# EAGLE design LnMasterInterface (EAGLE 9.6.2)
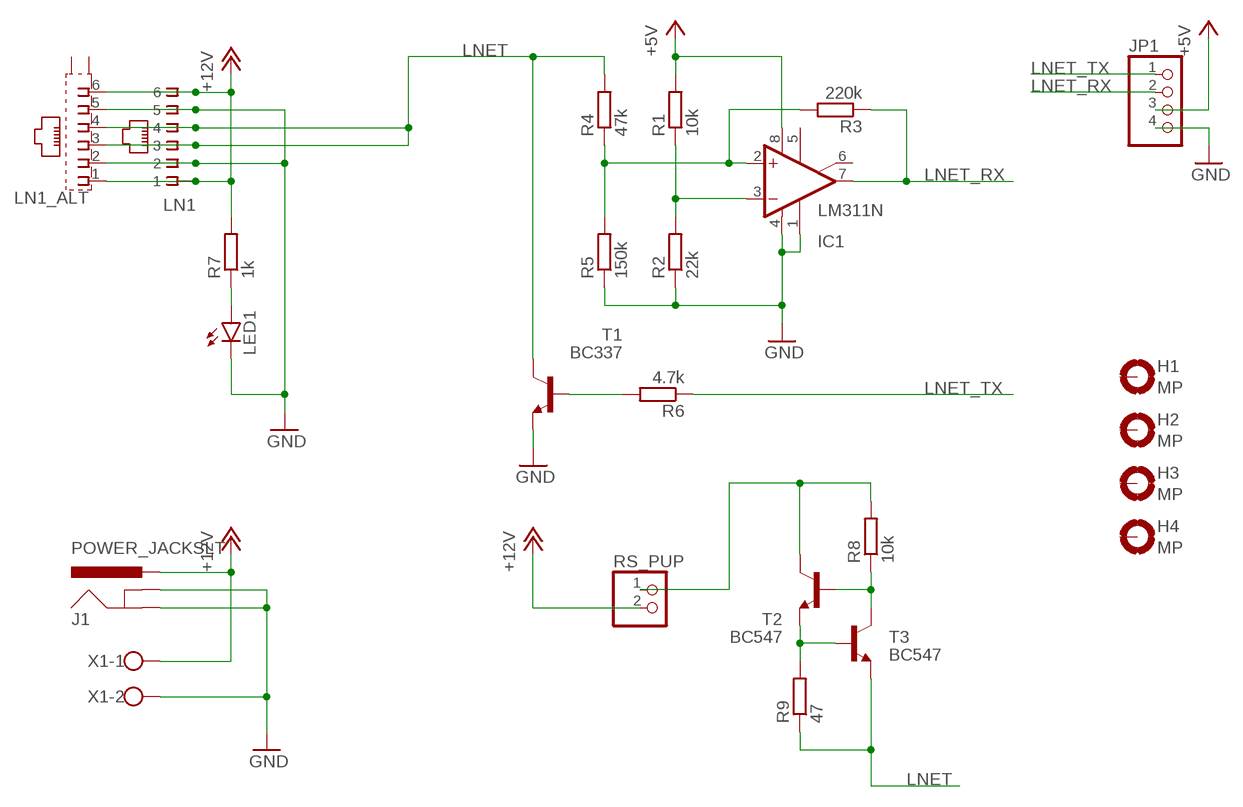
[diagram p0: schematic, sheet 1]

## Parts
H1  MP  MOUNT-PAD-ROUND3.0  [3,0-PAD]
H2  MP  MOUNT-PAD-ROUND3.0  [3,0-PAD]
H3  MP  MOUNT-PAD-ROUND3.0  [3,0-PAD]
H4  MP  MOUNT-PAD-ROUND3.0  [3,0-PAD]
IC1  LM311N  [DIL08]
J1  POWER_JACKSLT  [POWER_JACK_SLOT]
JP1  PINHD-1X4  [1X04]
LED1  LED3MM  [LED3MM]
LN1  RJ11-6X  [RJ11-NO_SHIELD]
LN1_ALT  YH-55-10  [YH-55-10]
R1  10k  R-EU_0207/2V  [0207/2V]
R2  22k  R-EU_0207/2V  [0207/2V]
R3  220k  R-EU_0207/2V  [0207/2V]
R4  47k  R-EU_0207/2V  [0207/2V]
R5  150k  R-EU_0207/2V  [0207/2V]
R6  4.7k  R-EU_0207/2V  [0207/2V]
R7  1k  R-EU_0207/2V  [0207/2V]
R8  10k  R-EU_0207/2V  [0207/2V]
R9  47  R-EU_0207/2V  [0207/2V]
RS_PUP  PINHD-1X2  [1X02]
T1  BC337  [TO92]
T2  BC547  [TO92]
T3  BC547  [TO92]
X1  W237-102  [W237-102]

## Nets
+5V: IC1.8(V+) JP1.3 R1.2
+12V [power]: J1.PWR LN1.1 LN1.6 LN1_ALT.1 LN1_ALT.6 R7.2 RS_PUP.2 X1.1
GND [power]: IC1.1(GND) IC1.4(V-) J1.GND@1(GNDBREAK) J1.GND@2(GND) JP1.4 LED1.K(C) LN1.2 LN1.5 LN1_ALT.2 LN1_ALT.5 R2.1 R5.1 T1.1(E) X1.2
LNET: LN1.3 LN1.4 LN1_ALT.3 LN1_ALT.4 R4.2 R9.1 T1.3(C) T3.1(E)
LNET_RX: IC1.7(OUT) JP1.2 R3.1
LNET_TX: JP1.1 R6.1
N$1: R6.2 T1.2(B)
N$2: LED1.A R7.1
N$3: IC1.3(-IN) R1.1 R2.2
N$5: IC1.2(+IN) R3.2 R4.1 R5.2
N$6 [power]: R9.2 T2.1(E) T3.2(B)
N$9 [power]: R8.1 T2.2(B) T3.3(C)
N$11 [power]: R8.2 RS_PUP.1 T2.3(C)
Unconnected: H1.B3,0(MOUNT) H2.B3,0(MOUNT) H3.B3,0(MOUNT) H4.B3,0(MOUNT) IC1.5(ON) IC1.6(ON/STR) LN1_ALT.S1(S) LN1_ALT.S2(S)

## Library data of the parts
H1-H4 = holes:MOUNT-PAD-ROUND: MOUNTING PAD, round
IC1 = linear:LM311: COMPARATOR
J1 = SparkFun-Connectors:POWER_JACK: Power Jack Connector This is the standard 5.5mm barrel jack for power. The PTH is the most common, proven, reliable, footprint. The Slot footprint only works if the mill layer is transmitted to the PCB fab house so be warned. Here are the connectors we sell at SparkFun: DC Barrel Power Jack/Connector <https://www.sparkfun.com/products/119> (PRT-00119) DC Barrel Power Jack/Connector (SMD) <https://www.sparkfun.com/products/12748> (PRT-12748) DC Barrel Jack Adapter - Breadboard Compatible <https://www.sparkfun.com/products/10811> (PRT-10811) It is used on this SparkFun product (and many, many others): SparkFun RedBoard - Programmed with Arduino <https://www.sparkfun.com/products/12757> (DEV-12757) Also, if you need a mating power supply or connector, please check these out: Wall Adapter Power Supply - 9VDC 650mA <https://www.sparkfun.com/products/298> (TOL-00298) DC Barrel Jack Adapter - Male <https://www.sparkfun.com/products/10287> (PRT-10287); PROD_ID: PRT-00119
JP1 = pinhead:PINHD-1X4: PIN HEADER
LED1 = led:LED: LED OSRAM: - CHIPLED LG R971, LG N971, LY N971, LG Q971, LY Q971, LO R971, LY R971 LH N974, LH R974 LS Q976, LO Q976, LY Q976 LO Q996 - Hyper CHIPLED LW Q18S LB Q993, LB Q99A, LB R99A - SideLED LS A670, LO A670, LY A670, LG A670, LP A670 LB A673, LV A673, LT A673, LW A673 LH A674 LY A675 LS A676, LA A676, LO A676, LY A676, LW A676 LS A679, LY A679, LG A679 - Hyper Micro SIDELED® LS Y876, LA Y876, LO Y876, LY Y876 LT Y87S - SmartLED LW L88C, LW L88S LB L89C, LB L89S, LG L890 LS L89K, LO L89K, LY L89K LS L896, LA L896, LO L896, LY L896 - TOPLED LS T670, LO T670, LY T670, LG T670, LP T670 LSG T670, LSP T670, LSY T670, LOP T670, LYG T670 LG T671, LOG T671, LSG T671 LB T673, LV T673, LT T673, LW T673 LH T674 LS T676, LA T676, LO T676, LY T676, LB T676, LH T676, LSB T676, LW T676 LB T67C, LV T67C, LT T67C, LS T67K, LO T67K, LY T67K, LW E67C LS E67B, LA E67B, LO E67B, LY E67B, LB E67C, LV E67C, LT E67C LW T67C LS T679, LY T679, LG T679 LS T770, LO T770, LY T770, LG T770, LP T770 LB T773, LV T773, LT T773, LW T773 LH T774 LS E675, LA E675, LY E675, LS T675 LS T776, LA T776, LO T776, LY T776, LB T776 LHGB T686 LT T68C, LB T68C - Hyper Mini TOPLED® LB M676 - Mini TOPLED Santana® LG M470 LS M47K, LO M47K, LY M47K Source: http://www.osram.convergy.de LUXEON: - LUMILED® LXK2-PW12-R00, LXK2-PW12-S00, LXK2-PW14-U00, LXK2-PW14-V00 LXK2-PM12-R00, LXK2-PM12-S00, LXK2-PM14-U00 LXK2-PE12-Q00, LXK2-PE12-R00, LXK2-PE12-S00, LXK2-PE14-T00, LXK2-PE14-U00 LXK2-PB12-K00, LXK2-PB12-L00, LXK2-PB12-M00, LXK2-PB14-N00, LXK2-PB14-P00, LXK2-PB14-Q00 LXK2-PR12-L00, LXK2-PR12-M00, LXK2-PR14-Q00, LXK2-PR14-R00 LXK2-PD12-Q00, LXK2-PD12-R00, LXK2-PD12-S00 LXK2-PH12-R00, LXK2-PH12-S00 LXK2-PL12-P00, LXK2-PL12-Q00, LXK2-PL12-R00 Source: www.luxeon.com KINGBRIGHT: KA-3528ASYC Source: www.kingbright.com
LN1 = con-tycoelectronics:RJ11: CORCOM Modular RJ Jacks No Shield Source: www.tycoelectronics.com .. ENG_DS_1654001_1099_RJ_L_0507.pdf; MPN: RJ11-6X; OC_FARNELL: unknown; OC_NEWARK: 16R6089
LN1_ALT = con-wenzhou-yihua:YH-55-10: RJ11 6 connects Source: YH-55-10.pdf; OC_FARNELL: unknown; OC_NEWARK: unknown
R1-R9 = rcl:R-EU_: RESISTOR, European symbol
RS_PUP = pinhead:PINHD-1X2: PIN HEADER
T1 = transistor:BC337: NPN TRANSISTOR
T2 T3 = transistor:BC547: NPN TRANSISTOR
X1 = con-wago-500:W237-102: WAGO SCREW CLAMP; MPN: 237-102; OC_FARNELL: unknown; OC_NEWARK: 70K9898

## Net classes
0 default: width 0.254 mm
1 power: width 1.016 mm

## Board
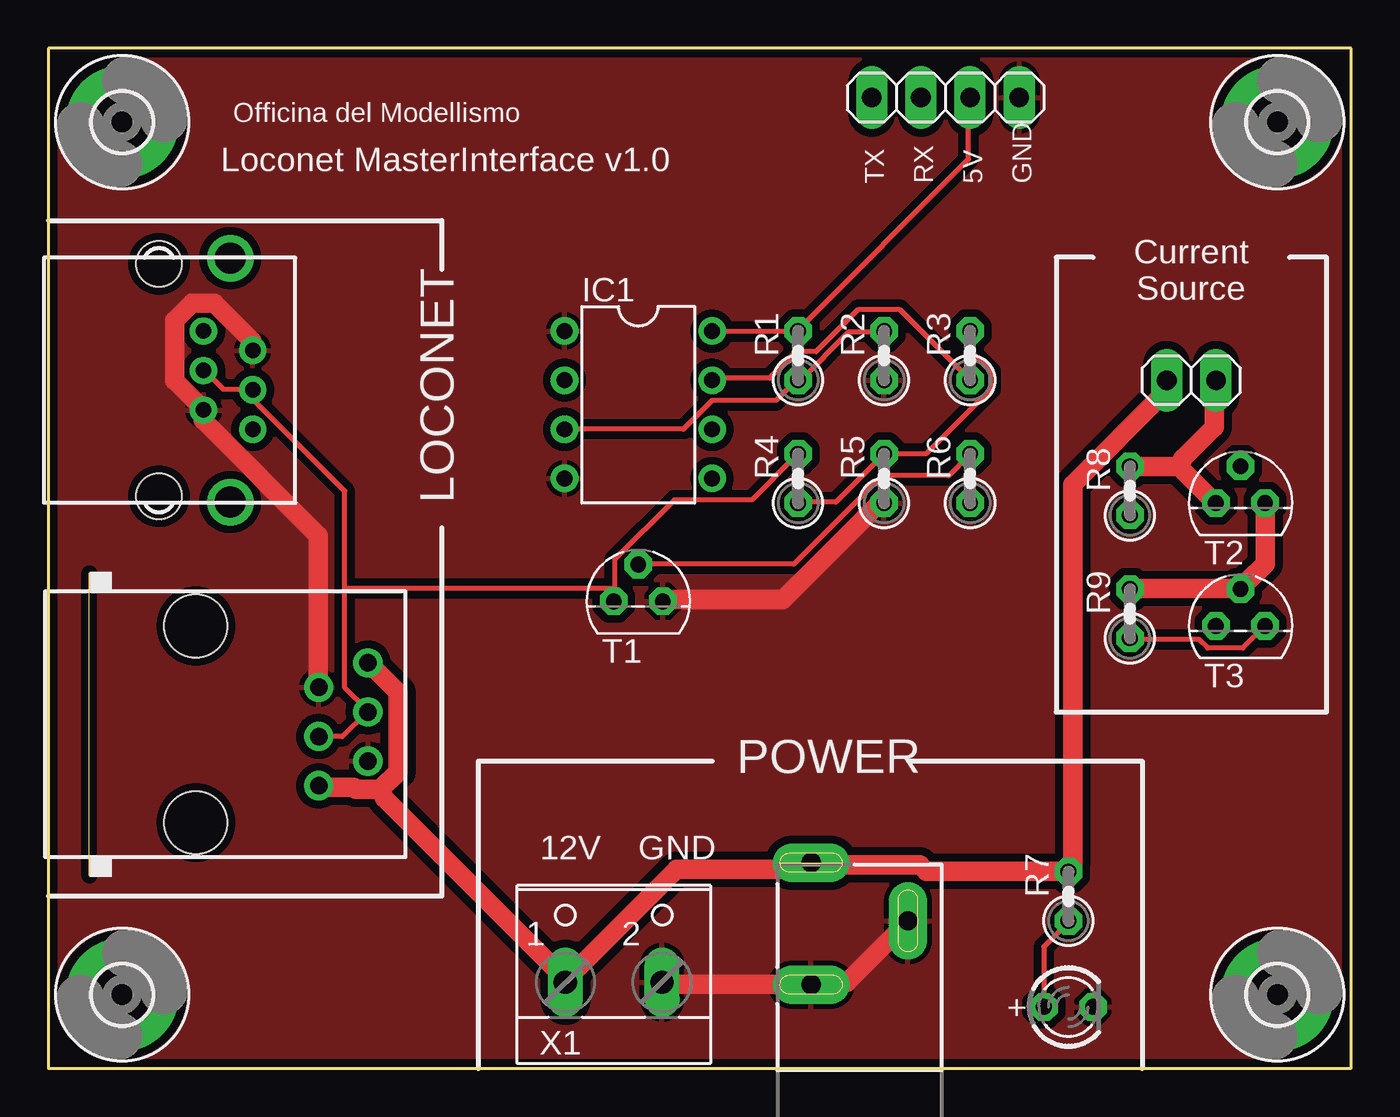
[diagram p1: board, top side]
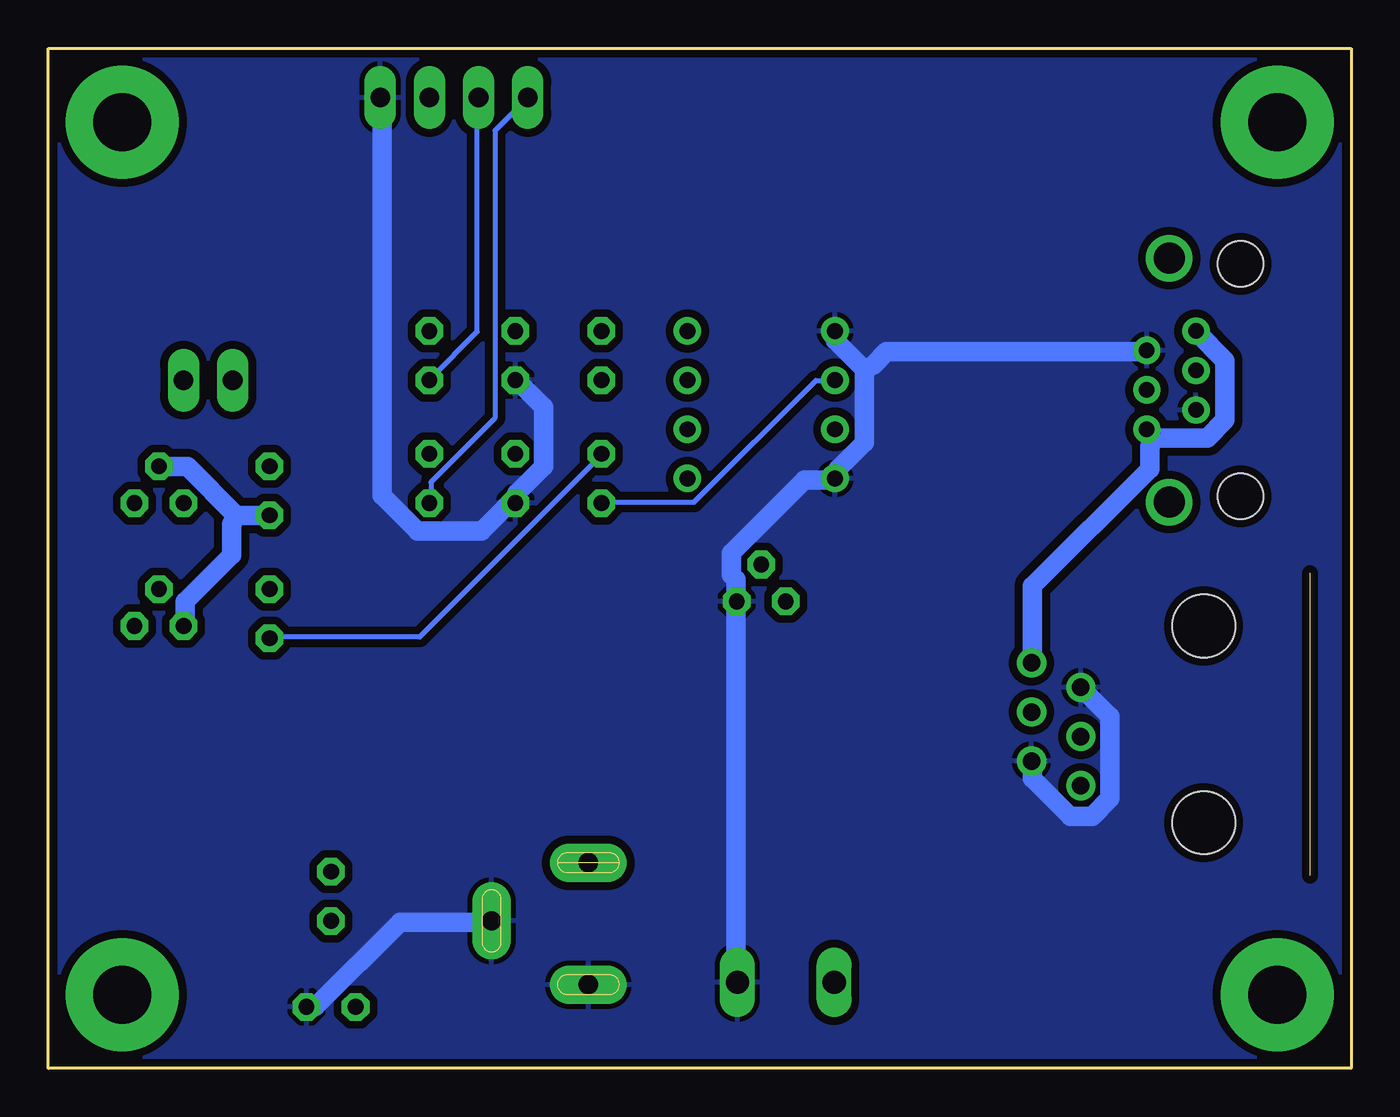
[diagram p2: board, bottom side, seen from below]

Size 67.31 x 52.7 mm. Coordinates in mm from the lower left corner, seen from the top.
Outline: 0,0 67.31,0 67.31,52.7 0,52.7 0,0
Copper layers (1*16): Top 0.035mm / dielectric 1.5mm / Bottom 0.035mm
Design rules "SparkFun": minimum track width 8mil, minimum drill 20mil, track to track 8mil, track to pad 8mil, pad to pad 8mil, via to via 8mil, smd to smd 8mil, copper to edge 10mil, drill to drill 8mil, minimum pad ring 12mil, minimum via ring 10mil, stop-mask expansion 4mil, vias tented up to drill 25mil, thermal gap 10mil

### Footprints (pad centres in the part's own frame; a part is rotated, then mirrored left to right if it is on the bottom)
3,0-PAD = drill 3 pad 5.842: B3,0 0,0
DIL08 = drill 0.813 pad 1.27: 1 -3.81,-3.81; 2 -1.27,-3.81; 3 1.27,-3.81; 4 3.81,-3.81; 5 3.81,3.81; 6 1.27,3.81; 7 -1.27,3.81; 8 -3.81,3.81
POWER_JACK_SLOT = drill 1 pad 2 long: GND@1 2.58,7.5; GND@2 7.58,10.8; PWR 2.58,13.8
1X04 = drill 1.016 long: 1 -3.81,0; 2 -1.27,0; 3 1.27,0; 4 3.81,0
LED3MM = drill 0.813 octagon: A -1.27,0; K 1.27,0
RJ11-NO_SHIELD = drill 0.9 pad 1.4: 1 -3.175,8.89; 2 -1.905,6.35; 3 -0.635,8.89; 4 0.635,6.35; 5 1.905,8.89; 6 3.175,6.35 | hole 3.251: -5.08,0; 5.08,0
YH-55-10 = drill 0.8 pad 1.3: 1 -2.54,2.3; 2 -1.54,4.84; 3 -0.5,2.3; 4 0.5,4.84; 5 1.54,2.3; 6 2.54,4.84 | drill 1.6 pad 2.184: S1 -6.3,3.68; S2 6.3,3.68 | hole 2.36: -6,0; 6,0
0207/2V = drill 0.813 octagon: 1 -1.27,0; 2 1.27,0
1X02 = drill 1.016 long: 1 -1.27,0; 2 1.27,0
TO92 = drill 0.813 octagon: 1 1.27,0; 2 0,1.905; 3 -1.27,0
W237-102 = drill 1.194 long: 1 -2.5,-1.27; 2 2.5,-1.27

### Placement (x,y rotation side)
H1  3.81,3.81 0 top
H2  3.81,48.9 0 top
H3  63.5,3.81 0 top
H4  63.5,48.9 0 top
IC1  30.48,34.29 270 top
J1  36.83,-3.17 0 top
JP1  46.35,50.16 0 top
LED1  52.7,3.17 0 top
LN1  7.62,17.78 270 top
LN1_ALT  5.71,35.56 270 top
R1  38.73,36.83 90 top
R2  43.18,36.83 90 top
R3  47.62,36.83 90 top
R4  38.73,30.48 90 top
R5  43.18,30.48 90 top
R6  47.62,30.48 90 top
R7  52.7,8.89 90 top
R8  55.88,29.84 90 top
R9  55.88,23.5 90 top
RS_PUP  59.05,35.56 180 top
T1  30.48,24.13 0 top
T2  61.59,29.21 0 top
T3  61.59,22.86 0 top
X1  29.21,5.71 0 top

### Tracks (layer width: path | path; a pad name or v marks a point on that pad's centre or on a via)
+5V
  Top 0.254: IC1.8 34.29,38.06 38.63,38.06 R1.2 38.75,38.18 47.55,46.98 47.55,50.06 JP1.3
+12V
  Top 1.016: RS_PUP.2 57.72,35.55 57.72,34.98 52.92,30.18 52.92,10.63 R7.2 52.69,10.17 45.38,10.17 45.03,10.52 39.43,10.52 J1.PWR 38.98,10.29 32.46,10.29 27.09,4.92 X1.1 26.63,4.46 26.63,4.69 17.37,13.95 17.14,14.4 | 17.14,14.4 15.89,14.4 15.77,14.52 14.06,14.52 LN1.6 | 17.14,14.4 18.06,15.32 18.06,19.43 16.57,20.92 LN1.1
  Bottom 1.016: 10.17,32.58 7.43,32.58 6.51,33.49 6.51,36.58 8,38.06 LN1_ALT.1 | 10.17,32.58 10.52,32.92 LN1_ALT.6 | 10.17,32.58 10.4,32.12 10.4,30.98 16.46,24.92 16.46,21.03 LN1.1
GND
  Top 1.016: X1.2 31.77,4.34 39.32,4.34 J1.GND@1 39.89,4.46 41.26,4.46 44.35,7.54 J1.GND@2 | LN1_ALT.2 10.52,37.15 10.52,37.6 8.57,39.55 7.43,39.55 6.51,38.63 6.51,35.55 8,34.06 LN1_ALT.5 8,33.49 13.95,27.55 13.95,19.77 LN1.2 | R5.1 43.09,29.15 42.86,29.15 37.95,24.23 31.77,24.23 T1.1
  Bottom 1.016: R2.1 43.09,35.55 41.72,34.18 41.72,31.09 43.09,29.72 43.09,29.26 R5.1 43.66,29.03 44.92,27.77 48.23,27.77 50.06,29.6 50.06,50.06 JP1.4 | LED1.K 53.95,3.2 53.49,3.2 49.15,7.54 44.46,7.54 J1.GND@2 | LN1.2 12.46,18.17 12.46,13.95 13.37,13.03 14.52,13.03 16.46,14.97 16.46,15.77 LN1.5 | 25.15,36.12 26.63,37.6 26.63,38.06 IC1.1 | 25.15,36.12 25.15,32.35 26.52,30.98 IC1.4 26.75,30.4 28.23,30.4 32,26.63 32,25.49 31.77,25.26 31.77,24.23 T1.1 31.77,23.66 31.77,4.46 X1.2 | LN1_ALT.2 10.63,37.03 24,37.03 24.69,36.35 25.15,36.12
  pour Top (isolate 0.406): 0,52.7 67.31,52.7 67.31,0 0,0
  pour Bottom (isolate 0.406): 0,52.7 67.31,52.7 67.31,0 0,0
LNET
  Top 0.254: LN1_ALT.3 8.12,36.01 9.03,35.09 10.52,35.09 LN1_ALT.4 10.63,34.98 10.63,34.52 15.32,29.83 15.32,24.8 | LN1.4 15.2,17.14 16.46,18.4 LN1.3 16.46,18.52 15.32,19.66 15.32,24.8 | T3.1 61.72,21.72 59.89,21.72 59.44,22.17 55.89,22.17 R9.1 | R4.2 38.63,31.66 36.35,29.38 32.35,29.38 29.26,26.29 29.26,24.23 T1.3 29.15,24.8 15.32,24.8
  Bottom 0.254: R9.1 55.78,22.29 48.12,22.29 38.75,31.66 R4.2
LNET_RX
  Top 0.254: IC1.7 34.29,35.66 37.26,35.66 38.63,37.03 39.66,37.03 41.83,39.2 44.01,39.2 47.55,35.66 R3.1
  Bottom 0.254: JP1.2 45.15,50.06 45.15,38.06 47.55,35.66 R3.1
LNET_TX
  Bottom 0.254: R6.1 47.55,29.26 47.55,30.29 44.23,33.6 44.23,48.46 42.63,50.06 JP1.1
N$1
  Top 0.254: T1.2 30.52,26.06 38.52,26.06 43.09,30.63 46.52,30.63 47.55,31.66 R6.2
N$2
  Top 0.254: LED1.A 51.44,6.29 52.69,7.54 R7.1
N$3
  Top 0.254: IC1.3 26.75,33.03 32.8,33.03 34.29,34.52 37.6,34.52 38.63,35.55 R1.1 38.86,35.55 41.38,38.06 43.09,38.06 R2.2
N$5
  Top 0.254: R4.1 38.75,29.26 40.69,29.26 R5.2 43.2,31.77 45.38,31.77 48.69,35.09 48.69,36.01 47.66,37.03 47.66,38.06 R3.2
  Bottom 0.254: IC1.2 26.75,35.55 27.66,35.55 33.95,29.26 38.63,29.26 R4.1
N$6
  Top 1.016: R9.2 55.89,24.8 61.49,24.8 T3.2 61.95,25.15 62.87,26.06 T2.1
N$9
  Bottom 1.016: 57.61,28.57 R8.1 | 57.61,28.57 60.12,31.09 61.49,31.09 T2.2 | T3.3 60.24,22.86 60.24,24.12 57.84,26.52 57.84,28.12 57.61,28.57
N$11
  Top 1.016: 58.41,31.09 55.89,31.09 R8.2 | 58.41,31.09 60.24,29.26 T2.3 | RS_PUP.1 60.24,35.55 60.24,33.15 58.64,31.55 58.41,31.09

### Text on the board
tNames: Officina del Modellismo | Loconet MasterInterface v1.0 | TX | RX | 5V | GND | Current / Source | LOCONET | POWER | 12V | GND | +